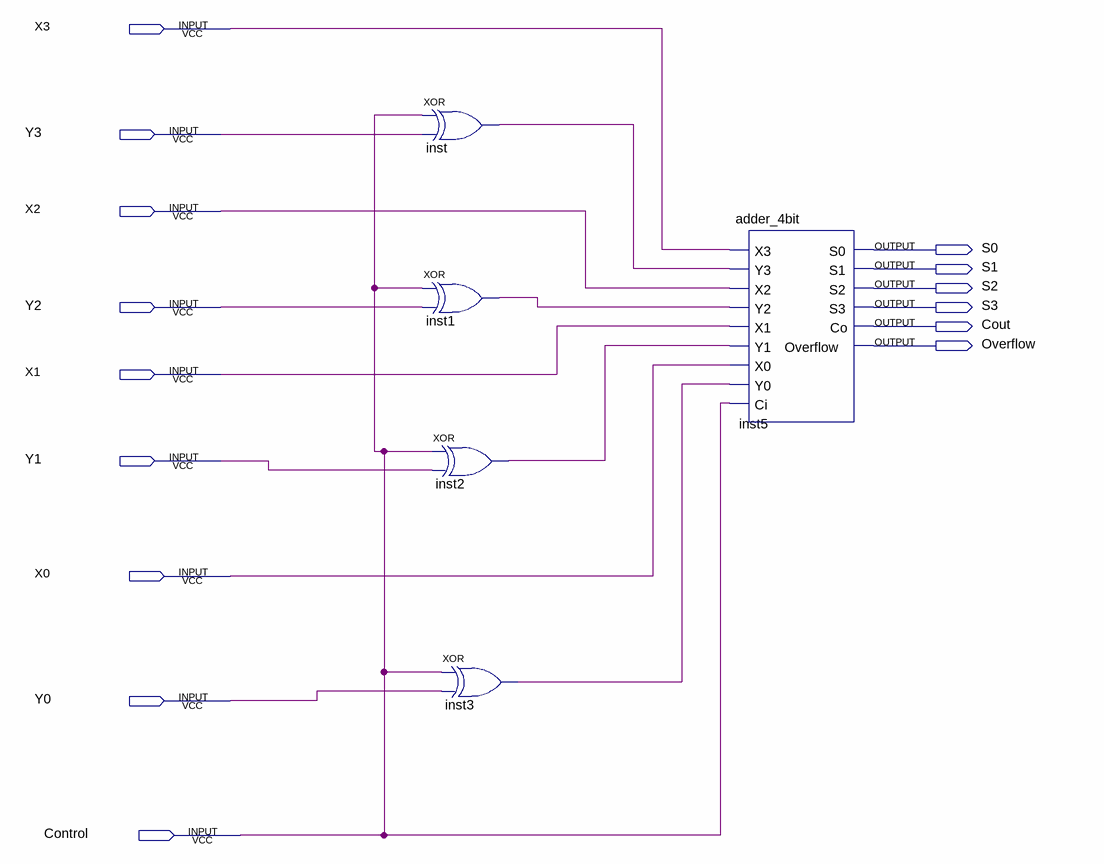
[diagram p0: schematic sheet]
// Quartus schematic lab7.bdf as structural Verilog: 5 symbols, 15 pins
module lab7 (
  input  X3,
  input  Y3,
  input  X2,
  input  Y2,
  input  X1,
  input  Y1,
  input  X0,
  input  Y0,
  input  Control,
  output S0,
  output S1,
  output S2,
  output S3,
  output Cout,
  output Overflow
);

  wire inst1_out, inst2_out, inst3_out, inst_out;

  xor inst (inst_out, Control, Y3);
  xor inst1 (inst1_out, Control, Y2);
  xor inst2 (inst2_out, Control, Y1);
  xor inst3 (inst3_out, Control, Y0);
  adder_4bit inst5 (
    .X3(X3), .Y3(inst_out), .X2(X2), .Y2(inst1_out), .X1(X1), .Y1(inst2_out), .X0(X0), .Y0(inst3_out),
    .Ci(Control), .S0(S0), .S1(S1), .S2(S2), .S3(S3), .Co(Cout), .Overflow(Overflow));
endmodule
